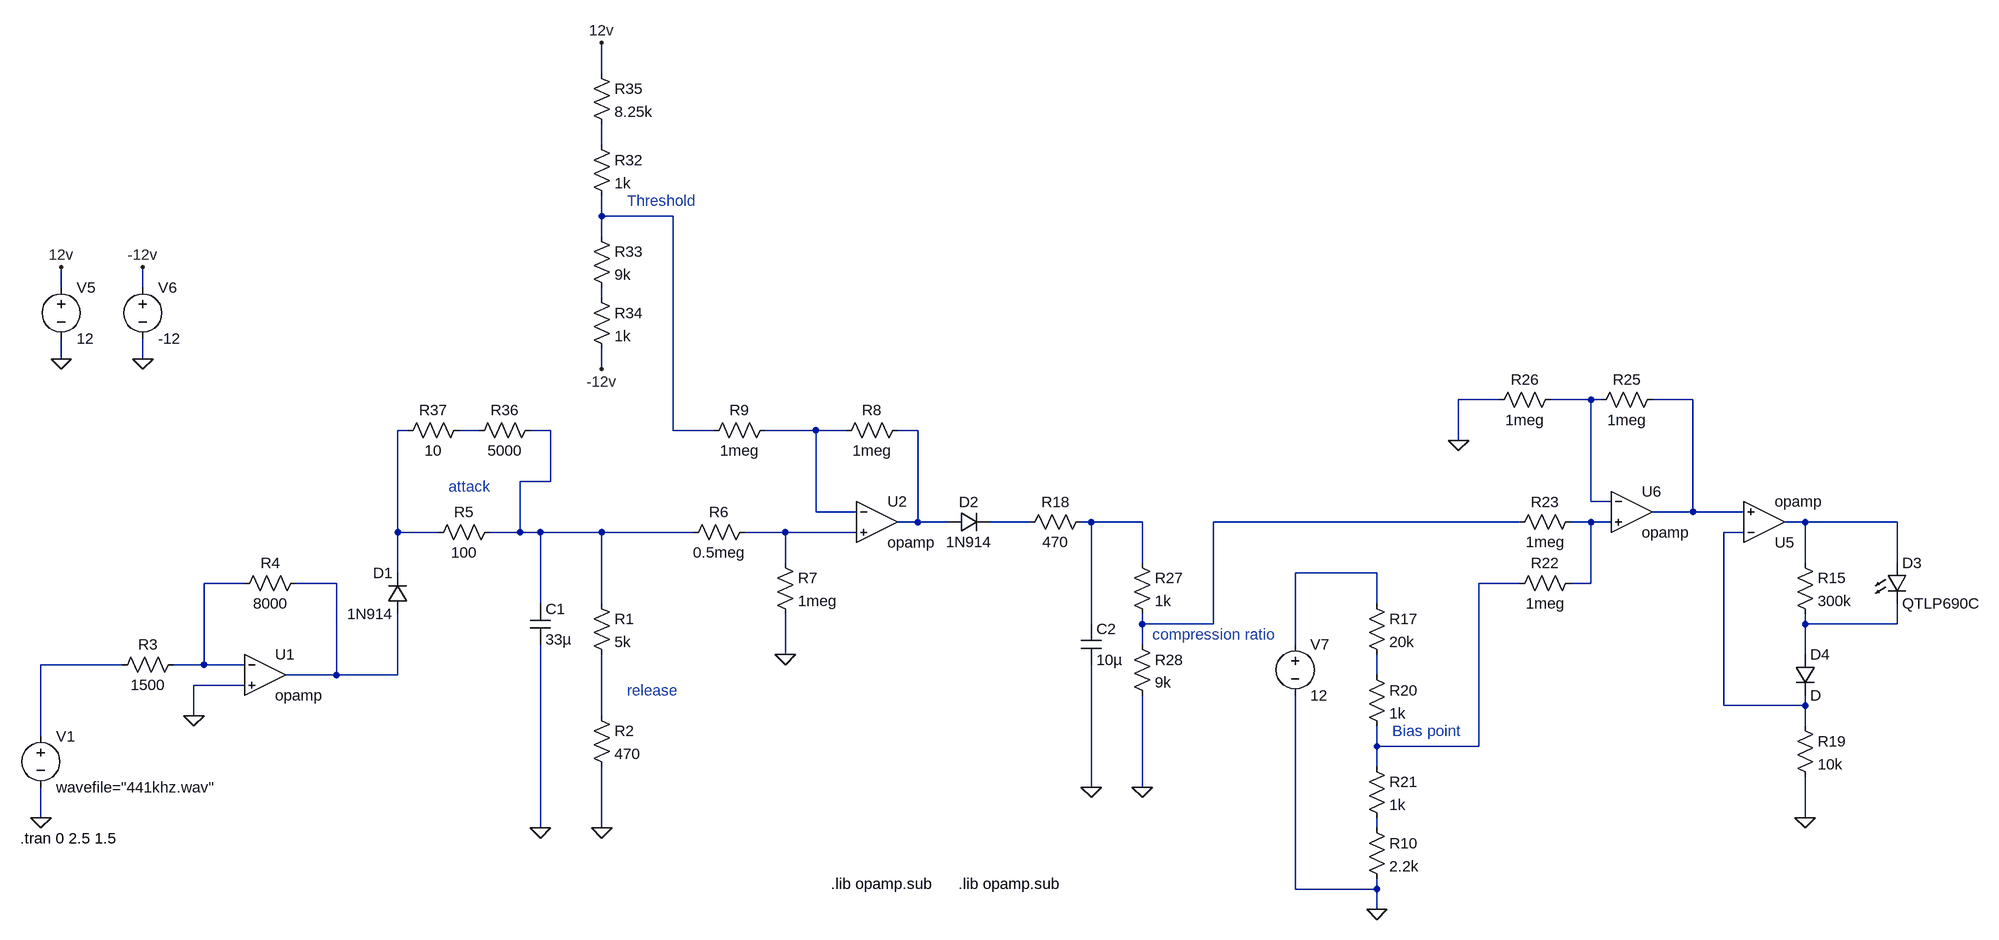
[diagram p0: schematic test_wavsource_2.asc]
test_wavsource_2.asc, the LTspice schematic file:
Version 4
SHEET 1 4852 868
WIRE 1808 -656 1808 -704
WIRE 1808 -544 1808 -576
WIRE 1808 -432 1808 -464
WIRE 1920 -432 1808 -432
WIRE 1808 -400 1808 -432
WIRE 960 -320 960 -352
WIRE 1088 -320 1088 -352
WIRE 1808 -304 1808 -320
WIRE 960 -208 960 -240
WIRE 1088 -208 1088 -240
WIRE 1808 -192 1808 -224
WIRE 3216 -144 3152 -144
WIRE 3360 -144 3296 -144
WIRE 3376 -144 3360 -144
WIRE 3520 -144 3456 -144
WIRE 1504 -96 1488 -96
WIRE 1616 -96 1584 -96
WIRE 1728 -96 1696 -96
WIRE 1920 -96 1920 -432
WIRE 1984 -96 1920 -96
WIRE 2144 -96 2064 -96
WIRE 2192 -96 2144 -96
WIRE 2304 -96 2272 -96
WIRE 3152 -80 3152 -144
WIRE 1728 -16 1728 -96
WIRE 1728 -16 1680 -16
WIRE 3360 16 3360 -144
WIRE 3392 16 3360 16
WIRE 2144 32 2144 -96
WIRE 2208 32 2144 32
WIRE 3520 32 3520 -144
WIRE 3520 32 3456 32
WIRE 3600 32 3520 32
WIRE 2304 48 2304 -96
WIRE 2304 48 2272 48
WIRE 2352 48 2304 48
WIRE 2480 48 2416 48
WIRE 2576 48 2560 48
WIRE 2656 48 2576 48
WIRE 3248 48 2768 48
WIRE 3360 48 3328 48
WIRE 3392 48 3360 48
WIRE 3696 48 3664 48
WIRE 3840 48 3696 48
WIRE 1488 64 1488 -96
WIRE 1552 64 1488 64
WIRE 1680 64 1680 -16
WIRE 1680 64 1632 64
WIRE 1712 64 1680 64
WIRE 1808 64 1712 64
WIRE 1952 64 1808 64
WIRE 2096 64 2032 64
WIRE 2208 64 2096 64
WIRE 3600 64 3568 64
WIRE 2096 112 2096 64
WIRE 2656 112 2656 48
WIRE 3696 112 3696 48
WIRE 3840 112 3840 48
WIRE 1488 128 1488 64
WIRE 3024 128 2896 128
WIRE 1248 144 1184 144
WIRE 1392 144 1328 144
WIRE 3248 144 3184 144
WIRE 3360 144 3360 48
WIRE 3360 144 3328 144
WIRE 1712 176 1712 64
WIRE 1808 176 1808 64
WIRE 3024 176 3024 128
WIRE 2576 208 2576 48
WIRE 2656 208 2656 192
WIRE 2768 208 2768 48
WIRE 2768 208 2656 208
WIRE 3696 208 3696 192
WIRE 3840 208 3840 176
WIRE 3840 208 3696 208
WIRE 2656 240 2656 208
WIRE 2896 240 2896 128
WIRE 2096 256 2096 192
WIRE 3696 256 3696 208
WIRE 1056 272 928 272
WIRE 1184 272 1184 144
WIRE 1184 272 1136 272
WIRE 1248 272 1184 272
WIRE 1392 288 1392 144
WIRE 1392 288 1312 288
WIRE 1488 288 1488 192
WIRE 1488 288 1392 288
WIRE 3024 288 3024 256
WIRE 1248 304 1168 304
WIRE 3568 336 3568 64
WIRE 3696 336 3696 320
WIRE 3696 336 3568 336
WIRE 1168 352 1168 304
WIRE 1808 352 1808 256
WIRE 3696 368 3696 336
WIRE 928 384 928 272
WIRE 3024 400 3024 368
WIRE 3184 400 3184 144
WIRE 3184 400 3024 400
WIRE 3024 432 3024 400
WIRE 2576 464 2576 272
WIRE 2656 464 2656 320
WIRE 928 512 928 464
WIRE 3696 512 3696 448
WIRE 1712 528 1712 240
WIRE 1808 528 1808 432
WIRE 3024 528 3024 512
WIRE 2896 624 2896 320
WIRE 3024 624 3024 608
WIRE 3024 624 2896 624
WIRE 3024 656 3024 624
FLAG 928 512 0
FLAG 1168 352 0
FLAG 1808 528 0
FLAG 1712 528 0
FLAG 3696 512 0
FLAG 3024 656 0
FLAG 3152 -80 0
FLAG 2656 464 0
FLAG 2576 464 0
FLAG 960 -208 0
FLAG 1088 -208 0
FLAG 1088 -352 -12v
FLAG 960 -352 12v
FLAG 1808 -704 12v
FLAG 1808 -192 -12v
FLAG 2096 256 0
SYMBOL voltage 928 368 R0
SYMATTR InstName V1
SYMATTR Value wavefile="441khz.wav"
SYMBOL diode 1504 192 R180
WINDOW 0 24 64 Left 2
WINDOW 3 24 0 Left 2
SYMATTR InstName D1
SYMATTR Value 1N914
SYMBOL cap 1696 176 R0
SYMATTR InstName C1
SYMATTR Value 33µ
SYMBOL res 1792 160 R0
SYMATTR InstName R1
SYMATTR Value 5k
SYMBOL Opamps\\opamp 1280 224 R0
SYMATTR InstName U1
SYMBOL res 1344 128 R90
WINDOW 0 0 56 VBottom 2
WINDOW 3 32 56 VTop 2
SYMATTR InstName R4
SYMATTR Value 8000
SYMBOL res 1152 256 R90
WINDOW 0 0 56 VBottom 2
WINDOW 3 32 56 VTop 2
SYMATTR InstName R3
SYMATTR Value 1500
SYMBOL res 1792 336 R0
SYMATTR InstName R2
SYMATTR Value 470
SYMBOL res 1536 80 R270
WINDOW 0 32 56 VTop 2
WINDOW 3 0 56 VBottom 2
SYMATTR InstName R5
SYMATTR Value 100
SYMBOL Opamps\\opamp 2240 -16 R0
SYMATTR InstName U2
SYMBOL res 2176 -80 R270
WINDOW 0 32 56 VTop 2
WINDOW 3 0 56 VBottom 2
SYMATTR InstName R8
SYMATTR Value 1meg
SYMBOL res 1968 -80 R270
WINDOW 0 32 56 VTop 2
WINDOW 3 0 56 VBottom 2
SYMATTR InstName R9
SYMATTR Value 1meg
SYMBOL diode 2352 64 R270
WINDOW 0 32 32 VTop 2
WINDOW 3 0 32 VBottom 2
SYMATTR InstName D2
SYMATTR Value 1N914
SYMBOL Opamps\\opamp 3632 112 M180
SYMATTR InstName U5
SYMBOL LED 3824 112 R0
SYMATTR InstName D3
SYMATTR Value QTLP690C
SYMATTR Description Diode
SYMATTR Type diode
SYMBOL diode 3680 256 R0
SYMATTR InstName D4
SYMBOL res 3680 96 R0
SYMATTR InstName R15
SYMATTR Value 300k
SYMBOL res 3680 352 R0
SYMATTR InstName R19
SYMATTR Value 10k
SYMBOL Opamps\\opamp 3424 -32 R0
SYMATTR InstName U6
SYMBOL res 3008 272 R0
SYMATTR InstName R20
SYMATTR Value 1k
SYMBOL res 3008 416 R0
SYMATTR InstName R21
SYMATTR Value 1k
SYMBOL res 3344 128 R90
WINDOW 0 0 56 VBottom 2
WINDOW 3 32 56 VTop 2
SYMATTR InstName R22
SYMATTR Value 1meg
SYMBOL res 3344 32 R90
WINDOW 0 0 56 VBottom 2
WINDOW 3 32 56 VTop 2
SYMATTR InstName R23
SYMATTR Value 1meg
SYMBOL voltage 2896 224 R0
WINDOW 123 0 0 Left 2
WINDOW 39 0 0 Left 2
SYMATTR InstName V7
SYMATTR Value 12
SYMBOL res 3472 -160 R90
WINDOW 0 0 56 VBottom 2
WINDOW 3 32 56 VTop 2
SYMATTR InstName R25
SYMATTR Value 1meg
SYMBOL res 3312 -160 R90
WINDOW 0 0 56 VBottom 2
WINDOW 3 32 56 VTop 2
SYMATTR InstName R26
SYMATTR Value 1meg
SYMBOL res 2640 96 R0
SYMATTR InstName R27
SYMATTR Value 1k
SYMBOL res 2640 224 R0
SYMATTR InstName R28
SYMATTR Value 9k
SYMBOL res 3008 512 R0
SYMATTR InstName R10
SYMATTR Value 2.2k
SYMBOL res 3008 160 R0
SYMATTR InstName R17
SYMATTR Value 20k
SYMBOL res 2464 64 R270
WINDOW 0 32 56 VTop 2
WINDOW 3 0 56 VBottom 2
SYMATTR InstName R18
SYMATTR Value 470
SYMBOL cap 2560 208 R0
SYMATTR InstName C2
SYMATTR Value 10µ
SYMBOL voltage 1088 -336 R0
WINDOW 123 0 0 Left 2
WINDOW 39 0 0 Left 2
SYMATTR InstName V6
SYMATTR Value -12
SYMBOL res 1792 -560 R0
SYMATTR InstName R32
SYMATTR Value 1k
SYMBOL res 1792 -416 R0
SYMATTR InstName R33
SYMATTR Value 9k
SYMBOL res 1792 -320 R0
SYMATTR InstName R34
SYMATTR Value 1k
SYMBOL res 1792 -672 R0
SYMATTR InstName R35
SYMATTR Value 8.25k
SYMBOL voltage 960 -336 R0
WINDOW 123 0 0 Left 2
WINDOW 39 0 0 Left 2
SYMATTR InstName V5
SYMATTR Value 12
SYMBOL res 1712 -112 R90
WINDOW 0 0 56 VBottom 2
WINDOW 3 32 56 VTop 2
SYMATTR InstName R36
SYMATTR Value 5000
SYMBOL res 1600 -112 R90
WINDOW 0 0 56 VBottom 2
WINDOW 3 32 56 VTop 2
SYMATTR InstName R37
SYMATTR Value 10
SYMBOL res 1936 80 R270
WINDOW 0 32 56 VTop 2
WINDOW 3 0 56 VBottom 2
SYMATTR InstName R6
SYMATTR Value 0.5meg
SYMBOL res 2080 96 R0
SYMATTR InstName R7
SYMATTR Value 1meg
TEXT 896 544 Left 2 !.tran 0 2.5 1.5
TEXT 2168 616 Left 2 !.lib opamp.sub
TEXT 2368 616 Left 2 !.lib opamp.sub
TEXT 1848 -456 Left 2 ;Threshold
TEXT 2672 224 Left 2 ;compression ratio
TEXT 3048 376 Left 2 ;Bias point
TEXT 1848 312 Left 2 ;release
TEXT 1568 -8 Left 2 ;attack

The netlist it stands for:
* test_wavsource_2.asc
V1 N023 0 wavefile="441khz.wav"
D1 N020 N006 1N914
C1 N008 0 33µ
R1 N008 N025 5k
XU1 N019 0 N020 opamp Aol=100K GBW=10Meg  ; pins invin noninvin out
R4 N020 N019 8000
R3 N019 N023 1500
R2 N025 0 470
R5 N006 N008 100
XU2 N009 N016 N010 opamp Aol=100K GBW=10Meg  ; pins invin noninvin out
R8 N009 N010 1meg
R9 N002 N009 1meg
D2 N010 N011 1N914
XU5 N017 N005 N015 opamp Aol=100K GBW=10Meg  ; pins invin noninvin out
D3 N015 N022 QTLP690C
D4 N022 N017 D
R15 N015 N022 300k
R19 N017 0 10k
XU6 N004 N014 N005 opamp Aol=100K GBW=10Meg  ; pins invin noninvin out
R20 N024 N021 1k
R21 N021 N026 1k
R22 N014 N021 1meg
R23 N014 N013 1meg
V7 N018 0 12
R25 N005 N004 1meg
R26 N004 0 1meg
R27 N012 N013 1k
R28 N013 0 9k
R10 N026 0 2.2k
R17 N018 N024 20k
R18 N011 N012 470
C2 N012 0 10µ
V6 -12v 0 -12
R32 N001 N002 1k
R33 N002 N003 9k
R34 N003 -12v 1k
R35 12v N001 8.25k
V5 12v 0 12
R36 N008 N007 5000
R37 N007 N006 10
R6 N008 N016 0.5meg
R7 N016 0 1meg
.model D D
.lib standard.dio
.tran 0 2.5 1.5
.lib opamp.sub
.lib opamp.sub
* Threshold
* compression ratio
* Bias point
* release
* attack
.backanno
.end